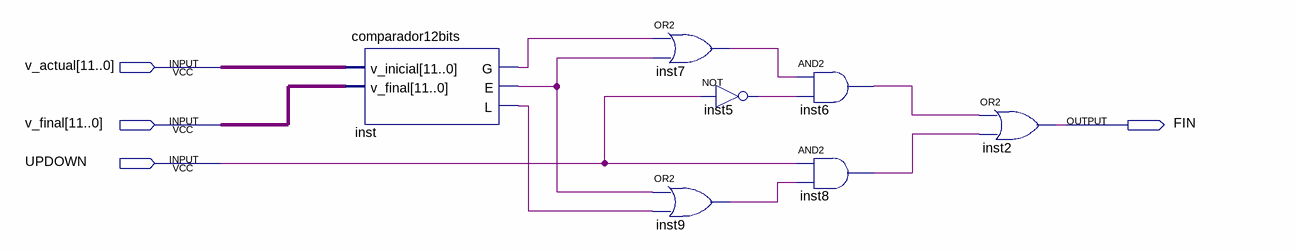
[diagram p0: schematic sheet]
// Quartus schematic ComparadorFIN.bdf as structural Verilog: 7 symbols, 4 pins
module ComparadorFIN (
  input  [11:0] v_actual,
  input  [11:0] v_final,
  input  UPDOWN,
  output FIN
);

  wire inst5_out, inst6_out, inst7_out, inst8_out, inst9_out, inst_e, inst_g, inst_l;

  comparador12bits inst (.v_inicial(v_actual), .v_final(v_final), .G(inst_g), .E(inst_e), .L(inst_l));
  or inst7 (inst7_out, inst_g, inst_e);
  or inst9 (inst9_out, inst_e, inst_l);
  not inst5 (inst5_out, UPDOWN);
  and inst6 (inst6_out, inst7_out, inst5_out);
  and inst8 (inst8_out, UPDOWN, inst9_out);
  or inst2 (FIN, inst6_out, inst8_out);
endmodule
